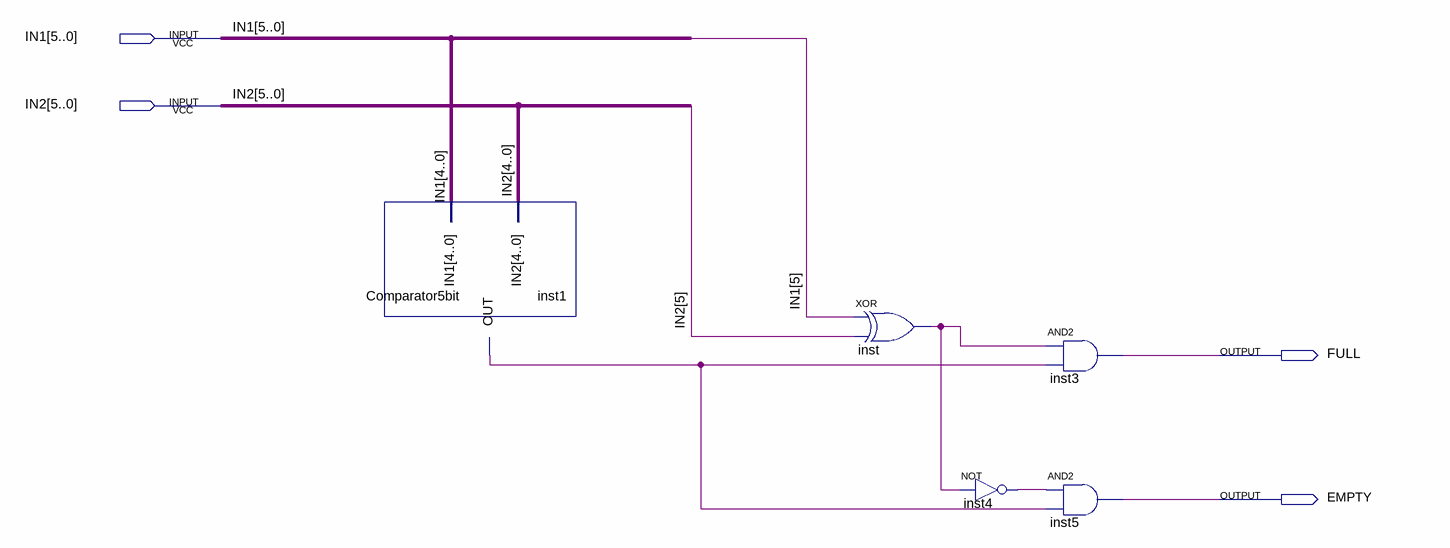
[diagram p0: schematic sheet]
// Quartus schematic FullAndEmpty.bdf as structural Verilog: 5 symbols, 4 pins
module FullAndEmpty (
  input  [5:0] IN1,
  input  [5:0] IN2,
  output FULL,
  output EMPTY
);

  wire inst1_out, inst4_out, inst_out;

  Comparator5bit inst1 (.IN1(IN1[4:0]), .IN2(IN2[4:0]), .OUT(inst1_out));
  xor inst (inst_out, IN1[5], IN2[5]);
  not inst4 (inst4_out, inst_out);
  and inst3 (FULL, inst_out, inst1_out);
  and inst5 (EMPTY, inst4_out, inst1_out);
endmodule
